# EAGLE design sch (EAGLE 7.4.0)
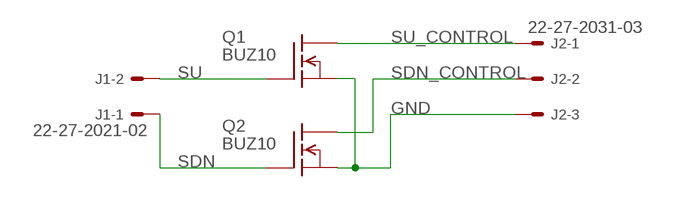
[diagram p0: schematic, sheet 1]

## Parts
J1  22-27-2021-02  [6410-02]
J2  22-27-2031-03  [6410-03]
Q1  BUZ10  [TO220]
Q2  BUZ10  [TO220]

## Nets
GND: J2.3 Q1.3(S) Q2.3(S)
SDN: J1.1 Q2.1(G)
SDN_CONTROL: J2.2 Q2.2(D)
SU: J1.2 Q1.1(G)
SU_CONTROL: J2.1 Q1.2(D)

## Library data of the parts
J1 = con-molex:22-?-02: CONNECTOR wire to board 2.54 mm (.1 inch) pitch header; OC_FARNELL: unknown; OC_NEWARK: unknown
J2 = con-molex:22-?-03: CONNECTOR wire to board 2.54 mm (.1 inch) pitch header; OC_FARNELL: unknown; OC_NEWARK: unknown
Q1 Q2 = transistor-fet:BUZ10: N-Channel Enhancement MOSFET 50V; 20A; 0,080Ohm

## Board
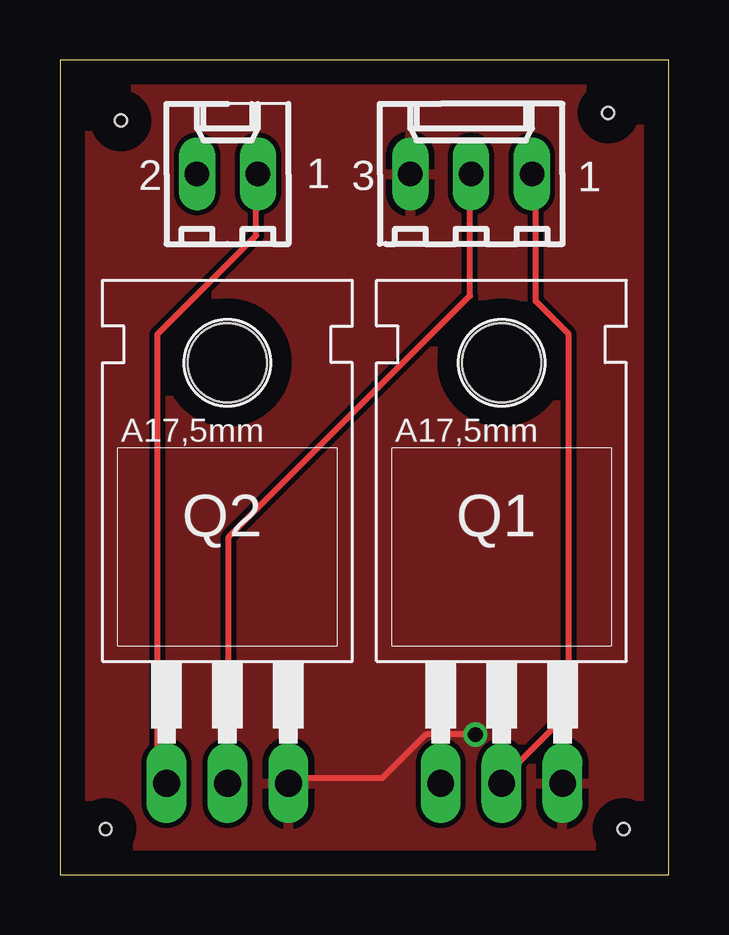
[diagram p1: board, top side]
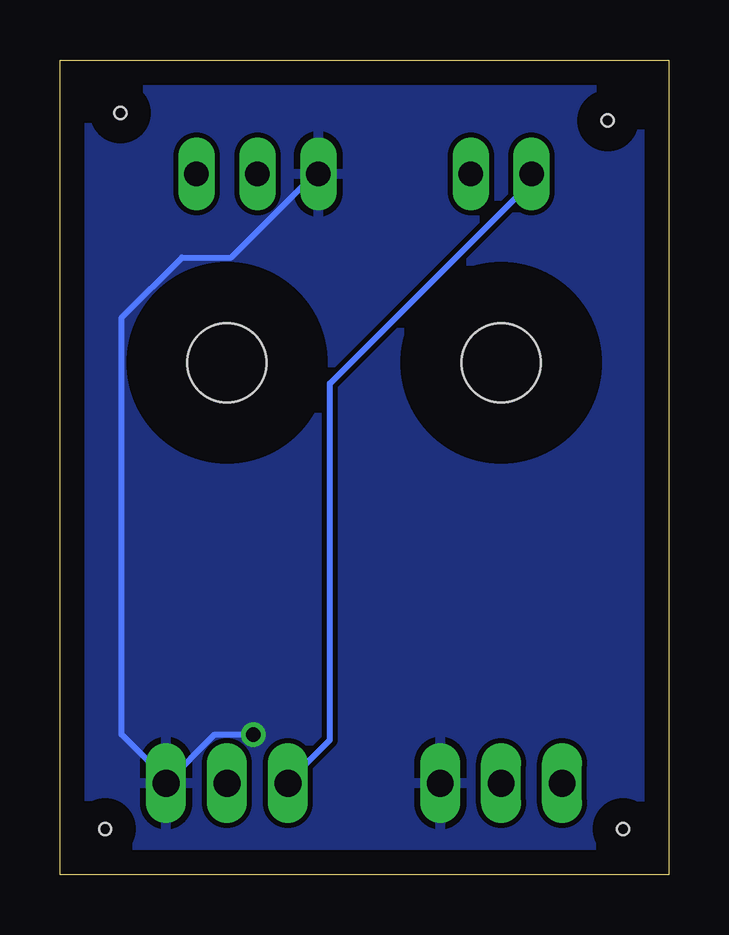
[diagram p2: board, bottom side, seen from below]

Size 25.38 x 33.96 mm. Coordinates in mm from the lower left corner, seen from the top.
Outline: 0,0 25.38,0 25.38,33.96 0,33.96 0,0
Copper layers (1*16): Top 0.035mm / dielectric 1.5mm / Bottom 0.035mm
Design rules "default": minimum track width 10mil, minimum drill 24mil, track to track 8mil, track to pad 8mil, pad to pad 8mil, via to via 8mil, smd to smd 8mil, copper to edge 40mil, drill to drill 8mil, minimum pad ring 10mil, minimum via ring 8mil, stop-mask expansion 4mil, vias tented up to drill 0mil, thermal gap 10mil
Holes 0.5 mm at 2.54,31.43 22.86,31.75 23.5,1.91 1.91,1.91

### Footprints (pad centres in the part's own frame; a part is rotated, then mirrored left to right if it is on the bottom)
6410-02 = drill 1.016 long: 1 1.27,0; 2 -1.27,0
6410-03 = drill 1.016 long: 1 2.54,0; 2 0,0; 3 -2.54,0
TO220 = drill 1.118 long: 1 -2.54,-6.35; 2 0,-6.35; 3 2.54,-6.35 | hole 3.302: 0,11.176

### Placement (x,y rotation side)
J1  6.99,29.21 0 top
J2  17.14,29.21 0 top
Q1  18.41,10.16 0 top
Q2  6.99,10.16 0 top

### Tracks (layer width: path | path; a pad name or v marks a point on that pad's centre or on a via)
GND  (via drill 0.61)
  Top 0.254: v17.32,5.84 15.27,5.84 13.44,4.01 9.55,4.01 Q2.3
  Bottom 0.254: J2.3 14.81,29.16 18.24,25.73 20.3,25.73 22.81,23.22 22.81,5.84 20.98,4.01 Q1.3 18.92,5.84 v17.32,5.84
  pour Top: 0,34.29 0,0 25.4,0 25.4,34.29
  pour Bottom: 0,34.29 0,0 25.4,0 25.4,34.29
SDN
  Top 0.254: J1.1 8.18,29.16 8.18,26.64 4.06,22.53 4.06,4.24 4.29,4.01 Q2.1
SDN_CONTROL
  Top 0.254: J2.2 17.09,29.16 17.09,24.13 7.04,14.07 7.04,4.01 Q2.2
SU
  Bottom 0.254: J1.2 5.89,29.16 5.89,28.7 14.12,20.47 14.12,5.61 15.72,4.01 Q1.1
SU_CONTROL
  Top 0.254: J2.1 19.84,29.16 19.84,23.9 21.21,22.53 21.21,6.76 18.47,4.01 Q1.2